# Altium schematic sheet 1x9x1_2.SchDoc
size A; SheetNumber: 2; SheetTotal: 3
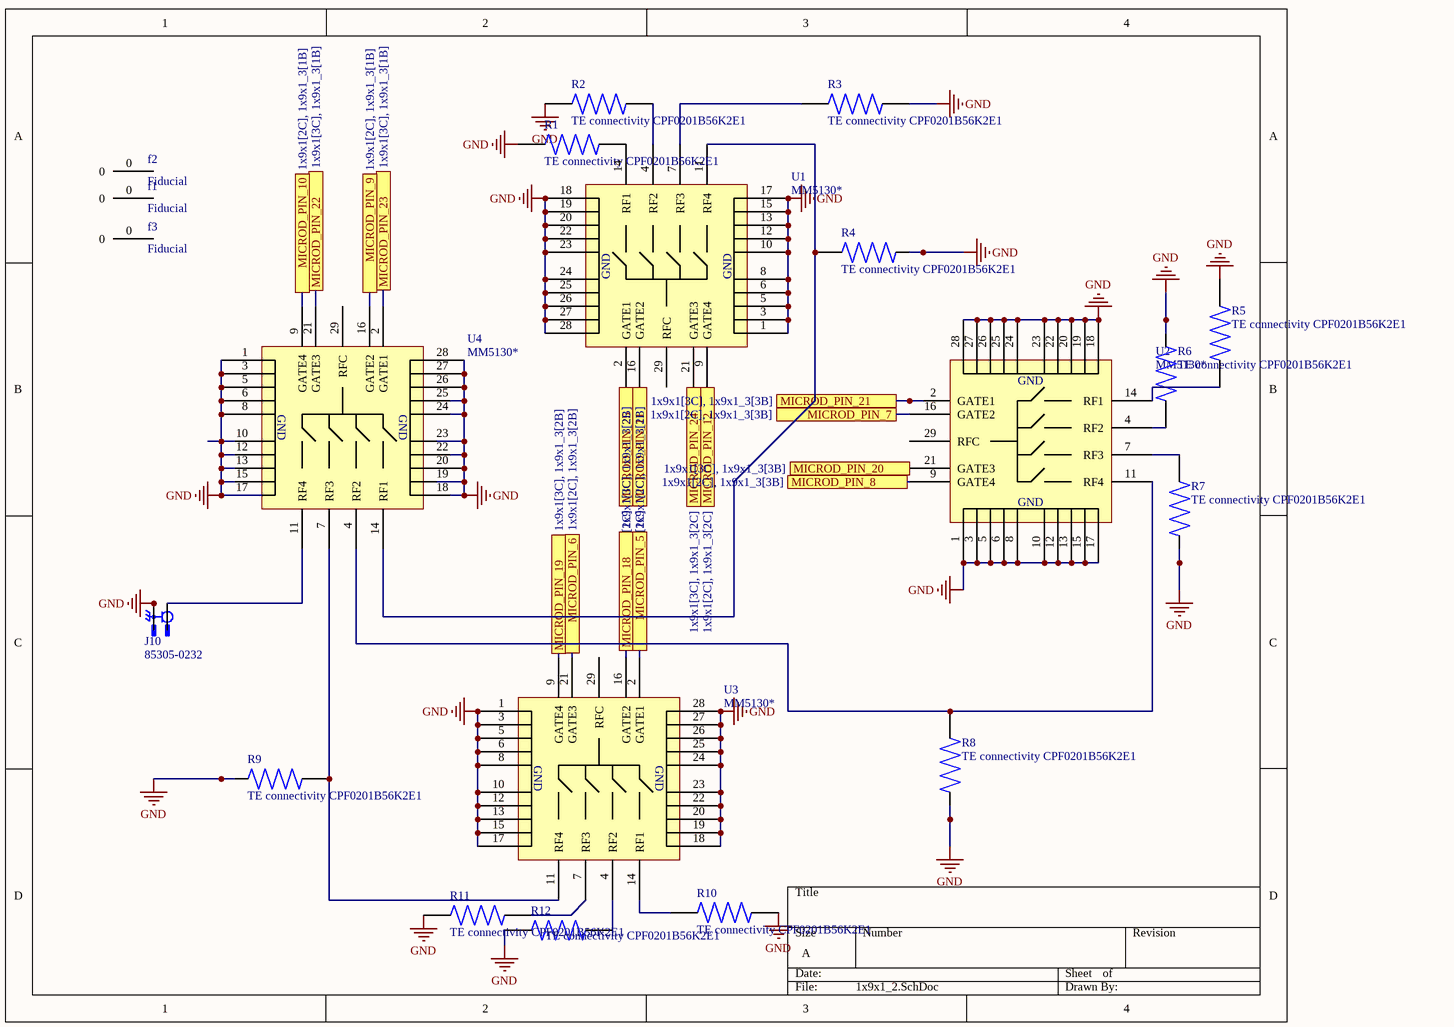
[diagram p0: 1x9x1_2.SchDoc]

## Parts
f1  Fiducial  [fiducial]
f2  Fiducial  [fiducial]
f3  Fiducial  [fiducial]
J10  85305-0232  [MOLEX_85305-0232]
R1  TE connectivity CPF0201B56K2E1  [0201-resistor]
R2  TE connectivity CPF0201B56K2E1  [0201-resistor]
R3  TE connectivity CPF0201B56K2E1  [0201-resistor]
R4  TE connectivity CPF0201B56K2E1  [0201-resistor]
R5  TE connectivity CPF0201B56K2E1  [0201-resistor]
R6  TE connectivity CPF0201B56K2E1  [0201-resistor]
R7  TE connectivity CPF0201B56K2E1  [0201-resistor]
R8  TE connectivity CPF0201B56K2E1  [0201-resistor]
R9  TE connectivity CPF0201B56K2E1  [0201-resistor]
R10  TE connectivity CPF0201B56K2E1  [0201-resistor]
R11  TE connectivity CPF0201B56K2E1  [0201-resistor]
R12  TE connectivity CPF0201B56K2E1  [0201-resistor]
U1  MM5130*  [MM5130-NORM_PCB_NOFLOOD]
U2  MM5130*  [MM5130-NORM_PCB_NOFLOOD]
U3  MM5130*  [MM5130-NORM_PCB_NOFLOOD]
U4  MM5130*  [MM5130-NORM_PCB_NOFLOOD]

## Ports
MICROD_PIN_5 (see 1x9x1[2C], 1x9x1_3[2B]), MICROD_PIN_6 (see 1x9x1[2C], 1x9x1_3[2B]), MICROD_PIN_7 (see 1x9x1[2C], 1x9x1_3[3B]), MICROD_PIN_8 (see 1x9x1[2C], 1x9x1_3[3B]), MICROD_PIN_9 (see 1x9x1[2C], 1x9x1_3[1B]), MICROD_PIN_10 (see 1x9x1[2C], 1x9x1_3[1B]), MICROD_PIN_11 (see 1x9x1[2C], 1x9x1_3[2C]), MICROD_PIN_12 (see 1x9x1[2C], 1x9x1_3[2C]), MICROD_PIN_18 (see 1x9x1[3C], 1x9x1_3[2B]), MICROD_PIN_19 (see 1x9x1[3C], 1x9x1_3[2B]), MICROD_PIN_20 (see 1x9x1[3C], 1x9x1_3[3B]), MICROD_PIN_21 (see 1x9x1[3C], 1x9x1_3[3B]), MICROD_PIN_22 (see 1x9x1[3C], 1x9x1_3[1B]), MICROD_PIN_23 (see 1x9x1[3C], 1x9x1_3[1B]), MICROD_PIN_24 (see 1x9x1[3C], 1x9x1_3[2C]), MICROD_PIN_25 (see 1x9x1[3C], 1x9x1_3[2C])

## Nets
GND: J10.2 J10.3 J10.4 J10.5 J10.6 J10.7 J10.8 J10.9 J10.10 J10.11 J10.12 J10.13 J10.14 J10.15 J10.16 J10.17 J10.18 R1.1 R2.2 R3.1 R4.1 R5.1 R6.1 R7.2 R8.2 R9.2 R10.1 R11.1 R12.2 U1.1(GND) U1.3(GND) U1.5(GND) U1.6(GND) U1.8(GND) U1.10(GND) U1.12(GND) U1.13(GND) U1.15(GND) U1.17(GND) U1.18(GND) U1.19(GND) U1.20(GND) U1.22(GND) U1.23(GND) U1.24(GND) U1.25(GND) U1.26(GND) U1.27(GND) U1.28(GND) U2.1(GND) U2.3(GND) U2.5(GND) U2.6(GND) U2.8(GND) U2.10(GND) U2.12(GND) U2.13(GND) U2.15(GND) U2.17(GND) U2.18(GND) U2.19(GND) U2.20(GND) U2.22(GND) U2.23(GND) U2.24(GND) U2.25(GND) U2.26(GND) U2.27(GND) U2.28(GND) U3.1(GND) U3.3(GND) U3.5(GND) U3.6(GND) U3.8(GND) U3.10(GND) U3.12(GND) U3.13(GND) U3.15(GND) U3.17(GND) U3.18(GND) U3.19(GND) U3.20(GND) U3.22(GND) U3.23(GND) U3.24(GND) U3.25(GND) U3.26(GND) U3.27(GND) U3.28(GND) U4.1(GND) U4.3(GND) U4.5(GND) U4.6(GND) U4.8(GND) U4.10(GND) U4.12(GND) U4.13(GND) U4.15(GND) U4.17(GND) U4.18(GND) U4.19(GND) U4.20(GND) U4.22(GND) U4.23(GND) U4.24(GND) U4.25(GND) U4.26(GND) U4.27(GND) U4.28(GND)
MICROD_PIN_5: U3.2(GATE1) ; port MICROD_PIN_5
MICROD_PIN_6: U3.21(GATE3) ; port MICROD_PIN_6
MICROD_PIN_7: U2.16(GATE2) ; port MICROD_PIN_7
MICROD_PIN_8: U2.9(GATE4) ; port MICROD_PIN_8
MICROD_PIN_9: U4.16(GATE2) ; port MICROD_PIN_9
MICROD_PIN_10: U4.9(GATE4) ; port MICROD_PIN_10
MICROD_PIN_11: U1.16(GATE2) ; port MICROD_PIN_11
MICROD_PIN_12: U1.9(GATE4) ; port MICROD_PIN_12
MICROD_PIN_18: U3.16(GATE2) ; port MICROD_PIN_18
MICROD_PIN_19: U3.9(GATE4) ; port MICROD_PIN_19
MICROD_PIN_20: U2.21(GATE3) ; port MICROD_PIN_20
MICROD_PIN_21: U2.2(GATE1) ; port MICROD_PIN_21
MICROD_PIN_22: U4.21(GATE3) ; port MICROD_PIN_22
MICROD_PIN_23: U4.2(GATE1) ; port MICROD_PIN_23
MICROD_PIN_24: U1.21(GATE3) ; port MICROD_PIN_24
MICROD_PIN_25: U1.2(GATE1) ; port MICROD_PIN_25
NetJ10_1: J10.1 U4.11(RF4)
NetR1_2: R1.2 U1.14(RF1)
NetR2_1: R2.1 U1.4(RF2)
NetR3_2: R3.2 U1.7(RF3)
NetR4_2: R4.2 U1.11(RF4) U4.14(RF1)
NetR5_2: R5.2 U2.14(RF1)
NetR6_2: R6.2 U2.4(RF2)
NetR7_1: R7.1 U2.7(RF3)
NetR8_1: R8.1 U2.11(RF4) U4.4(RF2)
NetR9_1: R9.1 U3.11(RF4) U4.7(RF3)
NetR10_2: R10.2 U3.14(RF1)
NetR11_2: R11.2 U3.7(RF3)
NetR12_1: R12.1 U3.4(RF2)

Not connected (* = marked no-connect by the designer): f1 0; f2 0; f3 0; U1 29(RFC); U2 29(RFC); U3 29(RFC); U4 29(RFC)

## Library data of the parts
J10 = 85305-0232: SMP Connector Plug, Male Pin 50Ohm Surface Mount Solder; MP: 853050232; MF: Molex; Check_prices: https://www.snapeda.com/parts/853050232/Molex/view-part/?ref=eda; Value: *; Availability: In Stock; Price: None; Package: None; SnapEDA_Link: https://www.snapeda.com/parts/853050232/Molex/view-part/?ref=snap; Purchase-URL: https://pricing.snapeda.com/search/part/853050232/?ref=eda
R1-R12 = TE connectivity CPF0201B56K2E1: CPF 0201 56K2 0.1% 25PPM 1K RL; MP: ERJ1GN0R00C; Value: 56k; Availability: Unavailable; Price: None; Package: None; Mfgr: TE connectivity; Mfgr Part No.: CPF0201B56K2E1
U1-U4 = IC-MM5130: High power SP4T MEMs switch